# Altium project SpaceDisplayOverheadLED.PrjPcb
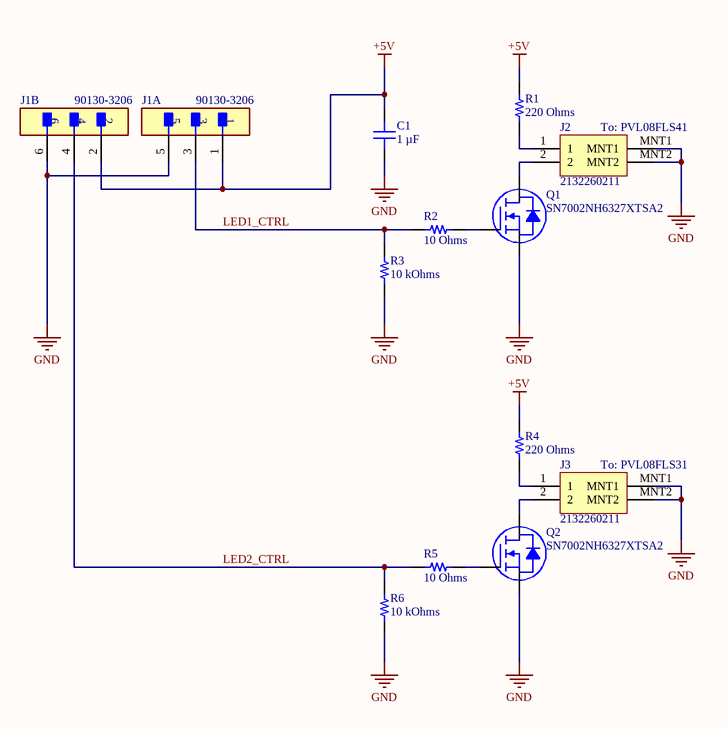
[diagram p0: SpaceDisplayOverheadLED_Schematic.SchDoc]
1 sheet, 12 parts. Net scope: global (net labels, ports and power ports of the same name join across sheets).
Board file: SpaceDisplayOverheadLED_PCB.PcbDoc

## Sheet SpaceDisplayOverheadLED_Schematic.SchDoc
size A; SheetNumber: 1; SheetTotal: 1

### Parts
C1  1 µF  [CAP 0603_1608]
J1  90130-3206  [FP-90130-3206-MFG]  (parts A,B of 2)
J2  2132260211  [2132260211]
J3  2132260211  [2132260211]
Q1  SN7002NH6327XTSA2  [INFINEON SOT-23-3]
Q2  SN7002NH6327XTSA2  [INFINEON SOT-23-3]
R1  220 Ohms  [RES 0603_1608]
R2  10 Ohms  [RES 0603_1608]
R3  10 kOhms  [RES 0603_1608]
R4  220 Ohms  [RES 0603_1608]
R5  10 Ohms  [RES 0603_1608]
R6  10 kOhms  [RES 0603_1608]

### Nets
+5V: C1.2 J1.1 J1.2 R1.2 R4.2
GND: C1.1 J1.5 J1.6 J2.MNT1 J2.MNT2 J3.MNT1 J3.MNT2 Q1.2(S) Q2.2(S) R3.1 R6.1
LED1_CTRL: J1.3 R2.1 R3.2
LED2_CTRL: J1.4 R5.1 R6.2
NetJ2_1: J2.1 R1.1
NetJ2_2: J2.2 Q1.3(D)
NetJ3_1: J3.1 R4.1
NetJ3_2: J3.2 Q2.3(D)
NetQ1_1: Q1.1(G) R2.2
NetQ2_1: Q2.1(G) R5.2

### Notes on the sheet
- (near J2) To: PVL08FLS41
- (near J3) To: PVL08FLS31

### Library data of the parts
C1 = CL10A105KA8NNNC: CAP CER 1UF 25V X5R 0603; manufacturer: Samsung Electro-Mechanics; Tolerance: ±10%; Part Number: CL10A105KA8NNNC; Capacitance: 1 µF; Applications: General Purpose; componentlink1description: Datasheet; componentlink1url: http://www.samsungsem.com/kr/support/product-search/mlcc/CL10A105KA8NNNC.jsp; componentlink2description: DigiKey Link; componentlink2url: https://www.digikey.com/en/products/detail/samsung-electro-mechanics/CL10A105KA8NNNC/3886760; Device Package: 0603 (1608 Metric); lastupdated: 2/9/2024 8:10:26 PM; Lifecycle Status: Active; Minimum Order: 1; Mounting Type: Surface Mount, MLCC; Operating Temperature: -55°C ~ 85°C; Package / Case: 0603 (1608 Metric); packaging: TapeAndReel; partid: 5508; Part Status: Active; price: 0.01; series: CL; Size / Dimension: 0.063" L x 0.031" W (1.60mm x 0.80mm); Supplier 1: DigiKey; Supplier Part Number 1: 1276-1102-1-ND; Temperature Coefficient: X5R; Thickness (Max): 0.035" (0.90mm); value: 1 µF; Voltage - Rated: 25V
J1 = CMP-00257-00655632-1: 90130-3206 Conn Shrouded Header (4 Sides) HDR 6 POS 2.54mm Solder RA Thru-Hole C-Grid III™ Frame; NexarPartId: 655632; Manufacturer Lifecycle Status: ACTIVE; Voltage Rating (DC): 350V; Lead Length: 2.9mm; Plating: Tin; Number of Circuits: 6; Mating Post Length: 6.75mm; Max Voltage Rating (DC): 350.35kV; Insulation Resistance: 5GΩ; Contact Resistance: 20mΩ; Glow Wire Compliant: Non-compliant; Current Rating: 3A; Gender: Male; System: Connector; Mount: Through Hole; Min Operating Temperature: -55°C; Material: Glass, Polyester; Termination: Through Hole; Pitch: 2.54mm; REACH SVHC: Unknown; Number of Rows: 2; Orientation: Right Angle; Radiation Hardening: No; Working Voltage: 350V; Voltage Rating: 350V; Lifecycle Status: Production; Number of Contacts: 6; RoHS: Compliant; Contact Gender: Male; Max Operating Temperature: 125°C; Contact Plating: Gold; Contact Material: Brass, Copper; Lead Pitch: 2.54mm; Voltage Rating (AC): 350V; Number of Poles: 6; Country of Origin: SK; Lead Free: Lead Free; Row Spacing: 2.54mm; Schedule B: 8536694040, 8536694040; Number of Positions: 6; Housing Color: Black; Color: Black; Housing Material: Polyester
Q1 Q2 = SN7002NH6327XTSA2: MOSFET N-CH 60V 200MA SOT23-3; Manufacturer: Infineon Technologies; Current - Continuous Drain (Id) @ 25°C: 200mA (Ta); Drive Voltage (Max Rds On,  Min Rds On): 4.5V, 10V; FET Type: N-Channel; Gate Charge (Qg) (Max) @ Vgs: 1.5 nC @ 10 V; Input Capacitance (Ciss) (Max) @ Vds: 45 pF @ 25 V; Power Dissipation (Max): 360mW (Ta); Rds On (Max) @ Id, Vgs: 5Ohm @ 500mA, 10V; Vgs (Max): ±20V; Vgs(th) (Max) @ Id: 1.8V @ 26µA; Part Number: SN7002NH6327XTSA2; ComponentLink1Description: Datasheet; ComponentLink1URL: https://www.infineon.com/dgdl/SN7002N_Rev2.6_.pdf?folderId=db3a3043156fd573011622e10b5c1f67&fileId=db3a304330f6860601311934e76045d5; ComponentLink2Description: DigiKey Link; ComponentLink2URL: https://www.digikey.com/en/products/detail/infineon-technologies/SN7002NH6327XTSA2/6164410; Drain to Source Voltage (Vdss): 60 V; LastUpdated: 6/3/2024 8:15:23 PM; Lifecycle Status: Active; Minimum Order: 1; Mounting Type: Surface Mount; Operating Temperature: -55°C ~ 150°C (TJ); Package / Case: TO-236-3, SC-59, SOT-23-3; Packaging: TapeAndReel; Part Status: Active; Price: 0.04; Series: SIPMOS®; Supplier 1: DigiKey; Supplier Part Number 1: SN7002NH6327XTSA2CT-ND; Supplier Device Package: PG-SOT23; Technology: MOSFET (Metal Oxide)
R1 R4 = RMCF0603FT220R: RES 220 OHM 1% 1/10W 0603; Manufacturer: Stackpole Electronics Inc; Power (Watts): 0.1W, 1/10W; Temperature Coefficient: ±100ppm/°C; Part Number: RMCF0603FT220R; Value: 220 Ohms; ComponentLink1Description: Datasheet; ComponentLink1URL: https://www.seielect.com/catalog/sei-rmcf_rmcp.pdf; ComponentLink2Description: DigiKey Link; ComponentLink2URL: https://www.digikey.com/en/products/detail/stackpole-electronics-inc/RMCF0603FT220R/1760809; Composition: Thick Film; Device Package: 0603 (1608 Metric); Features: Automotive AEC-Q200; Height - Seated (Max): 0.022" (0.55mm); LastUpdated: 2/9/2024 8:43:32 PM; Lifecycle Status: Active; Minimum Order: 1; Number of Terminations: 2; Operating Temperature: -55°C ~ 155°C; Package / Case: 0603 (1608 Metric); Packaging: CutTape; PartId: 6086; Part Status: Active; Price: 0.01; Ratings: AEC-Q200; Resistance: 220 Ohms; Series: RMCF; Size / Dimension: 0.061" L x 0.031" W (1.55mm x 0.80mm); Supplier 1: DigiKey; Supplier Part Number 1: RMCF0603FT220RCT-ND; Supplier Device Package: 0603; Tolerance: ±1%
R2 R5 = RMCF0603FT10R0: RES 10 OHM 1% 1/10W 0603; Manufacturer: Stackpole Electronics Inc; Power (Watts): 0.1W, 1/10W; Temperature Coefficient: ±100ppm/°C; Part Number: RMCF0603FT10R0; Value: 10 Ohms; ComponentLink1Description: Datasheet; ComponentLink1URL: https://www.seielect.com/catalog/sei-rmcf_rmcp.pdf; ComponentLink2Description: DigiKey Link; ComponentLink2URL: https://www.digikey.com/en/products/detail/stackpole-electronics-inc/RMCF0603FT10R0/1761152; Composition: Thick Film; Device Package: 0603 (1608 Metric); Features: Automotive AEC-Q200; Height - Seated (Max): 0.022" (0.55mm); LastUpdated: 2/9/2024 8:43:32 PM; Lifecycle Status: Active; Minimum Order: 1; Number of Terminations: 2; Operating Temperature: -55°C ~ 155°C; Package / Case: 0603 (1608 Metric); Packaging: CutTape; PartId: 6083; Part Status: Active; Price: 0.01; Ratings: AEC-Q200; Resistance: 10 Ohms; Series: RMCF; Size / Dimension: 0.061" L x 0.031" W (1.55mm x 0.80mm); Supplier 1: DigiKey; Supplier Part Number 1: RMCF0603FT10R0CT-ND; Supplier Device Package: 0603; Tolerance: ±1%
R3 R6 = RMCF0603FT10K0: RES 10K OHM 1% 1/10W 0603; Manufacturer: Stackpole Electronics Inc; Power (Watts): 0.1W, 1/10W; Temperature Coefficient: ±100ppm/°C; Part Number: RMCF0603FT10K0; Value: 10 kOhms; ComponentLink1Description: Datasheet; ComponentLink1URL: https://www.seielect.com/catalog/sei-rmcf_rmcp.pdf; ComponentLink2Description: DigiKey Link; ComponentLink2URL: https://www.digikey.com/en/products/detail/stackpole-electronics-inc/RMCF0603FT10K0/1761235; Composition: Thick Film; Device Package: 0603 (1608 Metric); Features: Automotive AEC-Q200; Height - Seated (Max): 0.022" (0.55mm); LastUpdated: 2/9/2024 8:42:00 PM; Lifecycle Status: Active; Minimum Order: 1; Number of Terminations: 2; Operating Temperature: -55°C ~ 155°C; Package / Case: 0603 (1608 Metric); Packaging: CutTape; PartId: 25663; Part Status: Active; Price: 0.01; Ratings: AEC-Q200; Resistance: 10 kOhms; Series: RMCF; Size / Dimension: 0.061" L x 0.031" W (1.55mm x 0.80mm); Supplier 1: DigiKey; Supplier Part Number 1: RMCF0603FT10K0CT-ND; Supplier Device Package: 0603; Tolerance: ±1%
J2 J3 = 2132260211: Supplier 1: DigiKey; Supplier Part Number 1: 900-2132260211CT-ND